# EAGLE design fabbot_v14 (EAGLE 7.4.0)
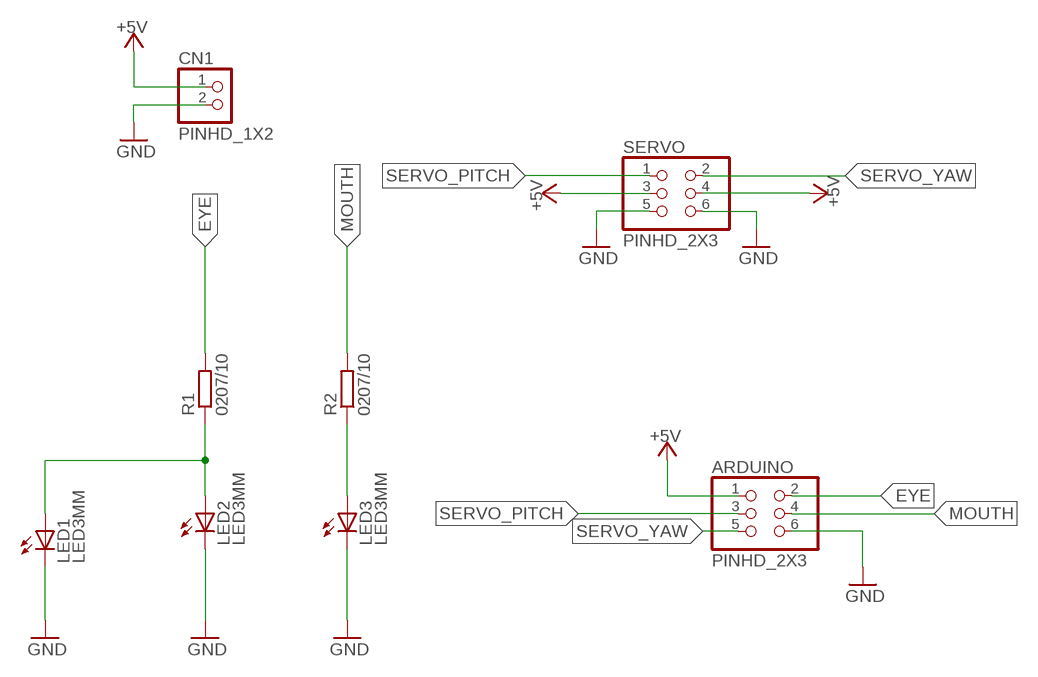
[diagram p0: schematic, sheet 1]

## Parts
ARDUINO  PINHD_2X3  [2X03/90]
CN1  PINHD_1X2  [PINHEAD1X2]
LED1  LED3MM  [LED3MM]
LED2  LED3MM  [LED3MM]
LED3  LED3MM  [LED3MM]
R1  0207/10  [0207/10]
R2  0207/10  [0207/10]
SERVO  PINHD_2X3  [2X03/90]

## Nets
+5V: ARDUINO.1 CN1.1 SERVO.3 SERVO.4
EYE: ARDUINO.2 R1.2
GND: ARDUINO.6 CN1.2 LED1.K(C) LED2.K(C) LED3.K(C) SERVO.5 SERVO.6
MOUTH: ARDUINO.4 R2.2
N$2: LED1.A LED2.A R1.1
N$4: LED3.A R2.1
SERVO_PITCH: ARDUINO.3 SERVO.1
SERVO_YAW: ARDUINO.5 SERVO.2

## Library data of the parts
ARDUINO SERVO = fabbot:PINHD_2X3
CN1 = fabbot:PINHD_1X2
LED1-LED3 = fabbot:LED3MM
R1 R2 = fabbot:0207/10

## Board
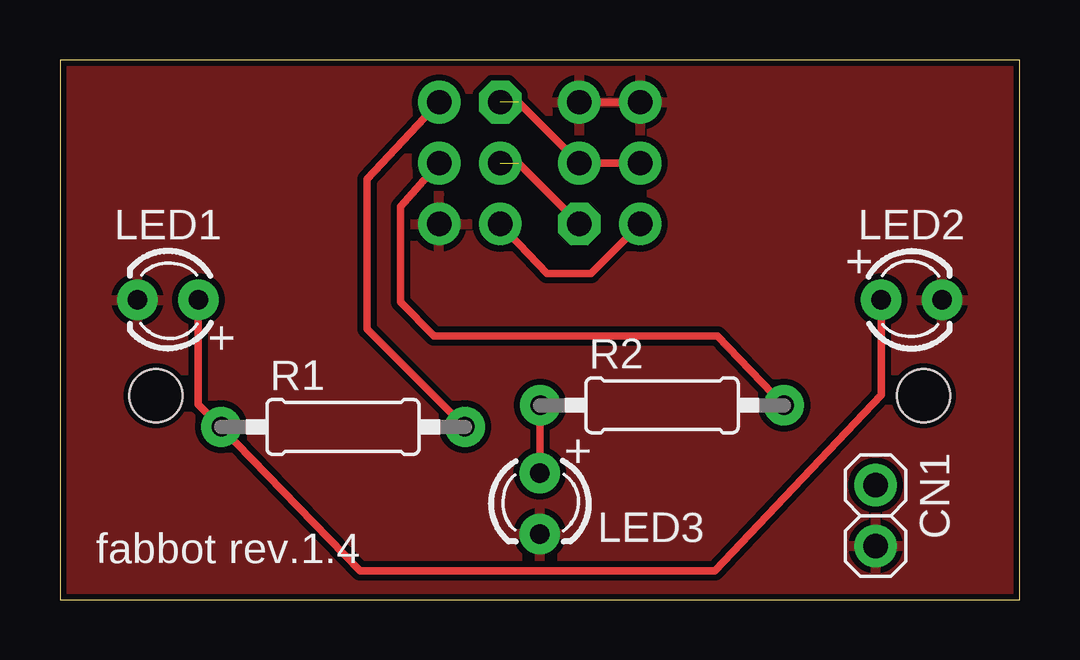
[diagram p1: board, top side]
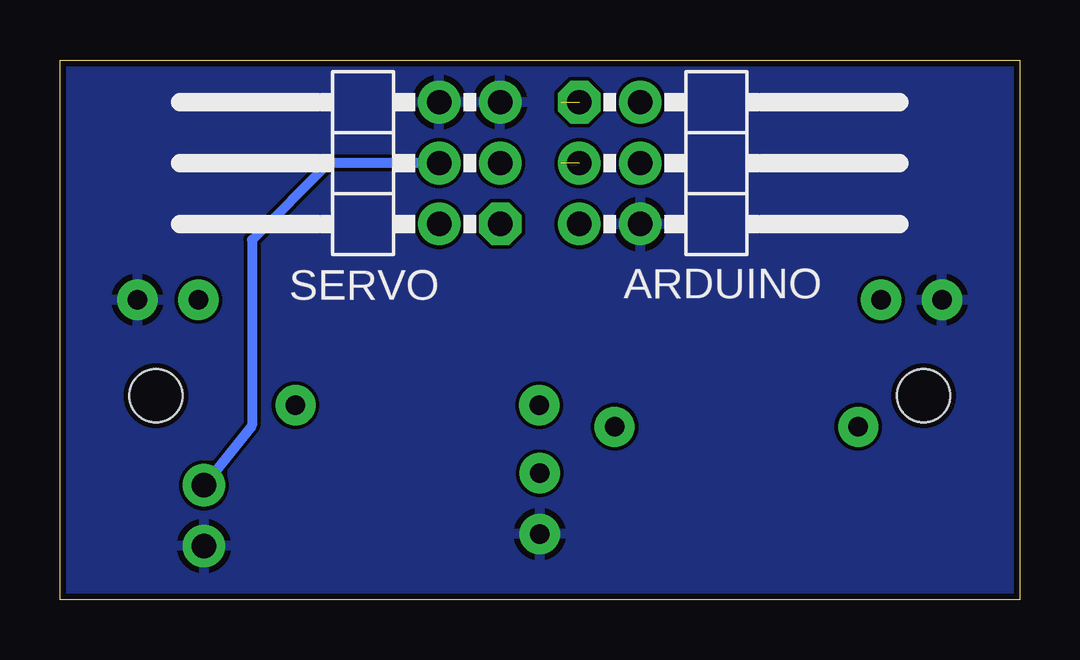
[diagram p2: board, bottom side, seen from below]

Size 40 x 22.5 mm. Coordinates in mm from the lower left corner, seen from the top.
Outline: 0,0 40,0 40,22.5 0,22.5 0,0
Copper layers (1*16): Top 0.035mm / dielectric 1.5mm / Bottom 0.035mm
Design rules "SeeedStudio_2layer_DRU_no_angle_20140221a": minimum track width 6mil, minimum drill 12mil, track to track 6mil, track to pad 6mil, pad to pad 6mil, via to via 6mil, smd to smd 0mil, copper to edge 10mil, drill to drill 10mil, minimum pad ring 10mil, minimum via ring 6mil, stop-mask expansion 2mil, vias tented up to drill 25mil, thermal gap 10mil
Holes 2.2 mm at 4,8.5 36,8.5

### Footprints (pad centres in the part's own frame; a part is rotated, then mirrored left to right if it is on the bottom)
2X03/90 = drill 1.016 pad 1.778 octagon: 1 -2.54,-6.35 | drill 1.016 pad 1.778: 2 -2.54,-3.81; 3 0,-6.35; 4 0,-3.81; 5 2.54,-6.35; 6 2.54,-3.81
PINHEAD1X2 = drill 1.016 pad 1.778: 1 -1.27,0; 2 1.27,0
LED3MM = drill 0.813 pad 1.676: A -1.27,0; K 1.27,0
0207/10 = drill 0.813 pad 1.676: 1 -5.08,0; 2 5.08,0

### Placement (x,y rotation side)
ARDUINO  12,18.2 270 bottom
CN1  34,3.5 270 top
LED1  4.5,12.5 180 top
LED2  35.5,12.5 0 top
LED3  20,4 270 top
R1  11.8,7.2 0 top
R2  25.1,8.1 0 top
SERVO  28,18.2 90 bottom

### Tracks (layer width: path | path; a pad name or v marks a point on that pad's centre or on a via)
+5V  (1 unrouted)
  Top 0.305: 19.11,20.74 SERVO.3 SERVO.4
  Bottom 0.406: SERVO.4 28.8,18.2 32,15 32,7.27 CN1.1
EYE
  Top 0.305: R1.2 12.8,11.28 12.8,17.53 ARDUINO.2
GND
  Top 0.305: SERVO.5 SERVO.6
  pour Top (isolate 0.254): 0,0 40,0 40,22.5 0,22.5
  pour Bottom: 0,0 40,0 40,22.5 0,22.5
MOUTH
  Top 0.305: R2.2 27.4,11 15.6,11 14.2,12.4 14.2,16.39 ARDUINO.4
N$2
  Top 0.305: LED2.A 34.23,8.53 27.3,1.2 12.5,1.2 6.7,7.2 | LED1.A 5.77,8.13 6.7,7.2 | R1.1 6.7,7.2 | 6.7,7.2 R1.1
N$4
  Top 0.305: R2.1 LED3.A
SERVO_PITCH  (1 unrouted)
  Top 0.305: SERVO.1 19.11,18.2
SERVO_YAW
  Top 0.305: SERVO.2 22.13,13.6 20.3,13.6 ARDUINO.5

### Text on the board
tPlace: fabbot rev.1.4